# EAGLE schematic FlexSensor_2in2 (EAGLE 9.3.0)
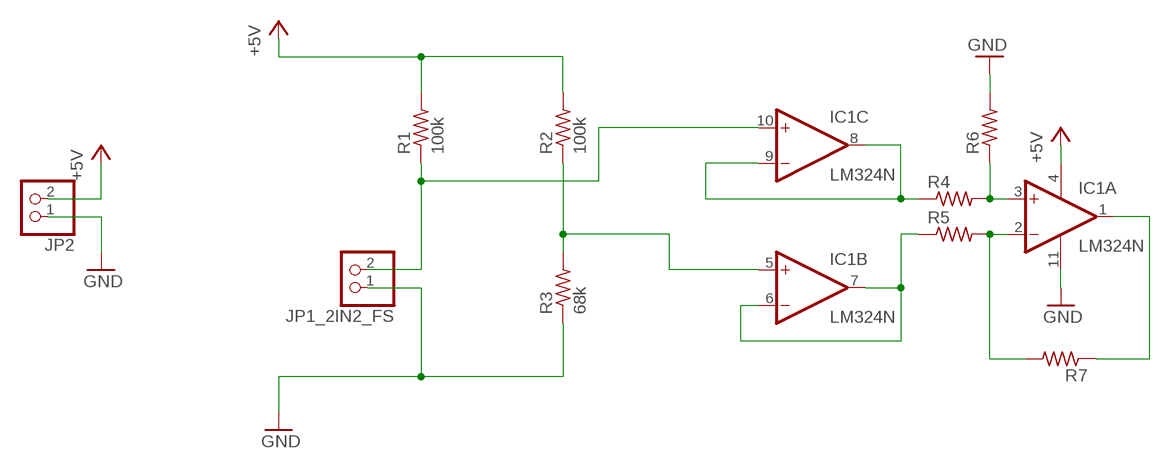
[diagram p0: schematic, sheet 1]

## Parts
IC1  LM324N  [DIL14]
JP1_2IN2_FS  PINHD-1X2  [1X02]
JP2  PINHD-1X2  [1X02]
R1  100k  R-US_0204/5  [0204/5]
R2  100k  R-US_0204/5  [0204/5]
R3  68k  R-US_0204/5  [0204/5]
R4  R-US_0204/7  [0204/7]
R5  R-US_0204/7  [0204/7]
R6  R-US_0204/7  [0204/7]
R7  R-US_0204/7  [0204/7]

## Nets
+5V: IC1.4(P:V+) JP2.2 R1.2 R2.2
GND: IC1.11(P:V-) JP1_2IN2_FS.1 JP2.1 R3.1 R6.2
N$1: IC1.10(C:+IN) JP1_2IN2_FS.2 R1.1
N$3: IC1.5(B:+IN) R2.1 R3.2
N$4: IC1.2(A:-IN) R5.2 R7.2
N$5: IC1.8(C:OUT) IC1.9(C:-IN) R4.1
N$6: IC1.6(B:-IN) IC1.7(B:OUT) R5.1
N$7: IC1.3(A:+IN) R4.2 R6.1
N$8: IC1.1(A:OUT) R7.1
Unconnected: IC1.12(D:+IN) IC1.13(D:-IN) IC1.14(D:OUT)

## Library data of the parts
IC1 = linear:LM324: OP AMP
JP1_2IN2_FS JP2 = pinhead:PINHD-1X2: PIN HEADER
R1-R7 = rcl:R-US_: RESISTOR, American symbol; SPICEPREFIX: R